# Altium schematic sheet Ring 3_A.SchDoc
size A; DocumentNumber: 9; SheetNumber: 14; SheetTotal: 30
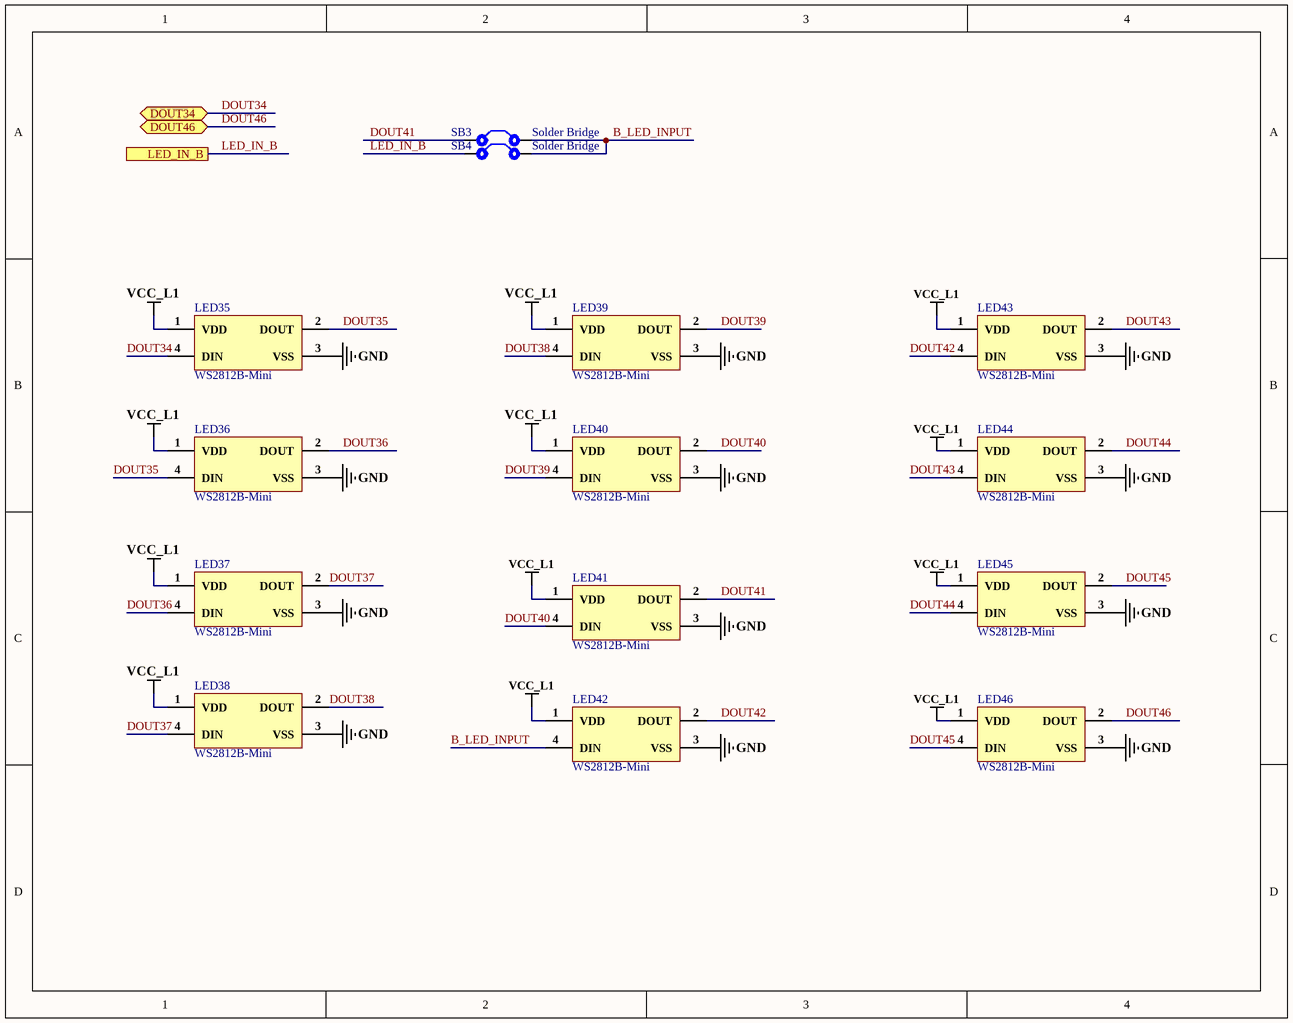
[diagram p0: Ring 3_A.SchDoc]

## Parts
LED35  WS2812B-Mini  [WS2812B-Mini]
LED36  WS2812B-Mini  [WS2812B-Mini]
LED37  WS2812B-Mini  [WS2812B-Mini]
LED38  WS2812B-Mini  [WS2812B-Mini]
LED39  WS2812B-Mini  [WS2812B-Mini]
LED40  WS2812B-Mini  [WS2812B-Mini]
LED41  WS2812B-Mini  [WS2812B-Mini]
LED42  WS2812B-Mini  [WS2812B-Mini]
LED43  WS2812B-Mini  [WS2812B-Mini]
LED44  WS2812B-Mini  [WS2812B-Mini]
LED45  WS2812B-Mini  [WS2812B-Mini]
LED46  WS2812B-Mini  [WS2812B-Mini]
SB3  Solder Bridge  [Solder Bridge]
SB4  Solder Bridge  [Solder Bridge]

## Ports
DOUT34 (bidir), DOUT46 (bidir), LED_IN_B

## Nets
GND: LED35.3(VSS) LED36.3(VSS) LED37.3(VSS) LED38.3(VSS) LED39.3(VSS) LED40.3(VSS) LED41.3(VSS) LED42.3(VSS) LED43.3(VSS) LED44.3(VSS) LED45.3(VSS) LED46.3(VSS)
VCC_L1: LED35.1(VDD) LED36.1(VDD) LED37.1(VDD) LED38.1(VDD) LED39.1(VDD) LED40.1(VDD) LED41.1(VDD) LED42.1(VDD) LED43.1(VDD) LED44.1(VDD) LED45.1(VDD) LED46.1(VDD)
B_LED_INPUT: LED42.4(DIN) SB3.2 SB4.2
DOUT34: LED35.4(DIN) ; port DOUT34
DOUT35: LED35.2(DOUT) LED36.4(DIN)
DOUT36: LED36.2(DOUT) LED37.4(DIN)
DOUT37: LED37.2(DOUT) LED38.4(DIN)
DOUT38: LED38.2(DOUT) LED39.4(DIN)
DOUT39: LED39.2(DOUT) LED40.4(DIN)
DOUT40: LED40.2(DOUT) LED41.4(DIN)
DOUT41: LED41.2(DOUT) SB3.1
DOUT42: LED42.2(DOUT) LED43.4(DIN)
DOUT43: LED43.2(DOUT) LED44.4(DIN)
DOUT44: LED44.2(DOUT) LED45.4(DIN)
DOUT45: LED45.2(DOUT) LED46.4(DIN)
DOUT46: LED46.2(DOUT) ; port DOUT46
LED_IN_B: SB4.1 ; port LED_IN_B

## Library data of the parts
LED35-LED46 = WS2812B-Mini: SMD,3.5x3.5mm Light Emitting Diodes (LED) RoHS; Manufacturer: Worldsemi; ComponentLink1Description: LCSC; ComponentLink1URL: *https://lcsc.com/product-detail/Light-Emitting-Diodes-LED_Worldsemi-WS2812B-Mini_C527089.html; Package: SMD,3.5x3.5mm; Parameter 1: *
SB3 SB4 = Solder Bridge: Solder Bridge ON